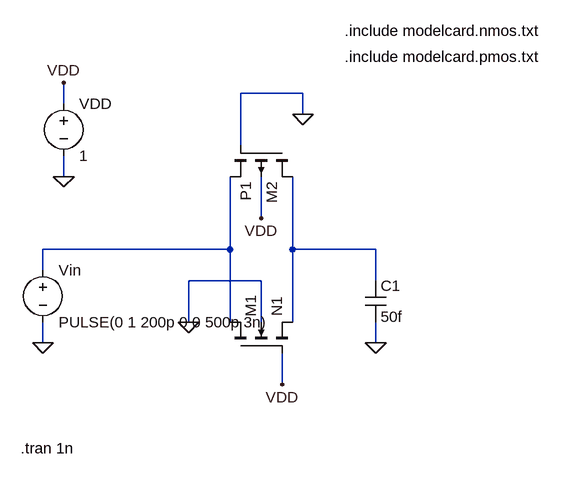
[diagram p0: schematic transmission gate.asc]
transmission gate.asc, the LTspice schematic file:
Version 4
SHEET 1 880 680
WIRE 352 -112 256 -112
WIRE -16 -96 -16 -128
WIRE 352 -80 352 -112
WIRE 256 -32 256 -112
WIRE -16 16 -16 -16
WIRE 288 80 288 16
WIRE 240 128 240 16
WIRE 240 128 -48 128
WIRE 336 128 336 16
WIRE 464 128 336 128
WIRE -48 160 -48 128
WIRE 288 176 176 176
WIRE 464 176 464 128
WIRE 176 240 176 176
WIRE 240 240 240 128
WIRE 288 240 288 176
WIRE 336 240 336 128
WIRE -48 272 -48 240
WIRE 464 272 464 240
WIRE 320 336 320 288
FLAG 352 -80 0
FLAG 320 336 VDD
FLAG 288 80 VDD
FLAG 176 240 0
FLAG 464 272 0
FLAG -16 16 0
FLAG -48 272 0
FLAG -16 -128 VDD
SYMBOL pmos4 336 -32 R90
SYMATTR InstName M2
SYMATTR Value P1
SYMATTR Value2 l=50n w=1u
SYMBOL nmos4 240 288 R270
SYMATTR InstName M1
SYMATTR Value N1
SYMATTR Value2 l=50n w=500n
SYMBOL cap 448 176 R0
SYMATTR InstName C1
SYMATTR Value 50f
SYMBOL voltage -16 -112 R0
SYMATTR InstName VDD
SYMATTR Value 1
SYMBOL voltage -48 144 R0
WINDOW 123 0 0 Left 0
WINDOW 39 0 0 Left 0
SYMATTR InstName Vin
SYMATTR Value PULSE(0 1 200p 0 0 500p 3n)
TEXT 416 -208 Left 2 !.include modelcard.nmos.txt
TEXT 416 -168 Left 2 !.include modelcard.pmos.txt
TEXT -82 434 Left 2 !.tran 1n

The netlist it stands for:
* transmission gate.asc
M2 N002 0 N001 VDD P1 l=50n w=1u
M1 N001 VDD N002 0 N1 l=50n w=500n
C1 N002 0 50f
VDD VDD 0 1
Vin N001 0 PULSE(0 1 200p 0 0 500p 3n)
.model NMOS NMOS
.model PMOS PMOS
.lib standard.mos
.include modelcard.nmos.txt
.include modelcard.pmos.txt
.tran 1n
.backanno
.end